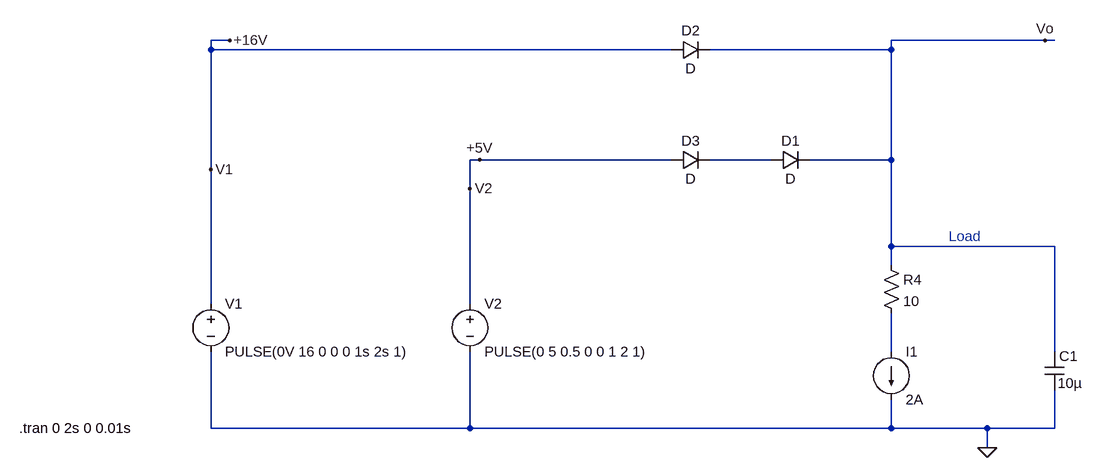
[diagram p0: schematic SourceSelect.asc]
SourceSelect.asc, the LTspice schematic file:
Version 4
SHEET 1 2776 680
WIRE 432 -544 400 -544
WIRE 2704 -544 2448 -544
WIRE 2720 -544 2704 -544
WIRE 400 -528 400 -544
WIRE 1168 -528 400 -528
WIRE 2448 -528 2448 -544
WIRE 2448 -528 1232 -528
WIRE 848 -16 832 -16
WIRE 1168 -16 848 -16
WIRE 1968 -16 1232 -16
WIRE 2448 -16 2448 -528
WIRE 2448 -16 2032 -16
WIRE 400 0 400 -528
WIRE 832 32 832 -16
WIRE 2448 128 2448 -16
WIRE 2720 128 2448 128
WIRE 2448 160 2448 128
WIRE 400 224 400 0
WIRE 832 224 832 32
WIRE 2448 304 2448 240
WIRE 2720 304 2720 128
WIRE 400 432 400 304
WIRE 832 432 832 304
WIRE 832 432 400 432
WIRE 2448 432 2448 384
WIRE 2448 432 832 432
WIRE 2608 432 2448 432
WIRE 2720 432 2720 368
WIRE 2720 432 2608 432
WIRE 2608 464 2608 432
FLAG 2608 464 0
FLAG 848 -16 +5V
FLAG 432 -544 +16V
FLAG 2704 -544 Vo
FLAG 832 32 V2
FLAG 400 0 V1
SYMBOL voltage 400 208 R0
WINDOW 123 0 0 Left 0
WINDOW 39 0 0 Left 0
SYMATTR InstName V1
SYMATTR Value PULSE(0V 16 0 0 0 1s 2s 1)
SYMBOL voltage 832 208 R0
WINDOW 123 0 0 Left 0
WINDOW 39 0 0 Left 0
SYMATTR InstName V2
SYMATTR Value PULSE(0 5 0.5 0 0 1 2 1)
SYMBOL diode 1168 -32 M90
WINDOW 0 0 32 VBottom 2
WINDOW 3 32 32 VTop 2
SYMATTR InstName D3
SYMBOL cap 2704 304 R0
WINDOW 3 21 53 Left 2
SYMATTR InstName C1
SYMATTR Value 10µ
SYMBOL current 2448 304 R0
WINDOW 123 0 0 Left 0
WINDOW 39 0 0 Left 0
SYMATTR InstName I1
SYMATTR Value 2A
SYMBOL diode 1968 0 R270
WINDOW 0 32 32 VTop 2
WINDOW 3 0 32 VBottom 2
SYMATTR InstName D1
SYMBOL res 2432 144 R0
SYMATTR InstName R4
SYMATTR Value 10
SYMBOL diode 1168 -512 R270
WINDOW 0 32 32 VTop 2
WINDOW 3 0 32 VBottom 2
SYMATTR InstName D2
TEXT -658 432 Left 2 !.tran 0 2s 0 0.01s
TEXT 2544 112 Left 2 ;Load

The netlist it stands for:
* SourceSelect.asc
V1 V1 0 PULSE(0V 16 0 0 0 1s 2s 1)
V2 V2 0 PULSE(0 5 0.5 0 0 1 2 1)
D3 V2 N001 D
C1 Vo 0 10µ
I1 N002 0 2A
D1 N001 Vo D
R4 Vo N002 10
D2 V1 Vo D
.model D D
.lib standard.dio
.tran 0 2s 0 0.01s
* Load
.backanno
.end